# Altium schematic sheet Sheet1.SchDoc
size A4
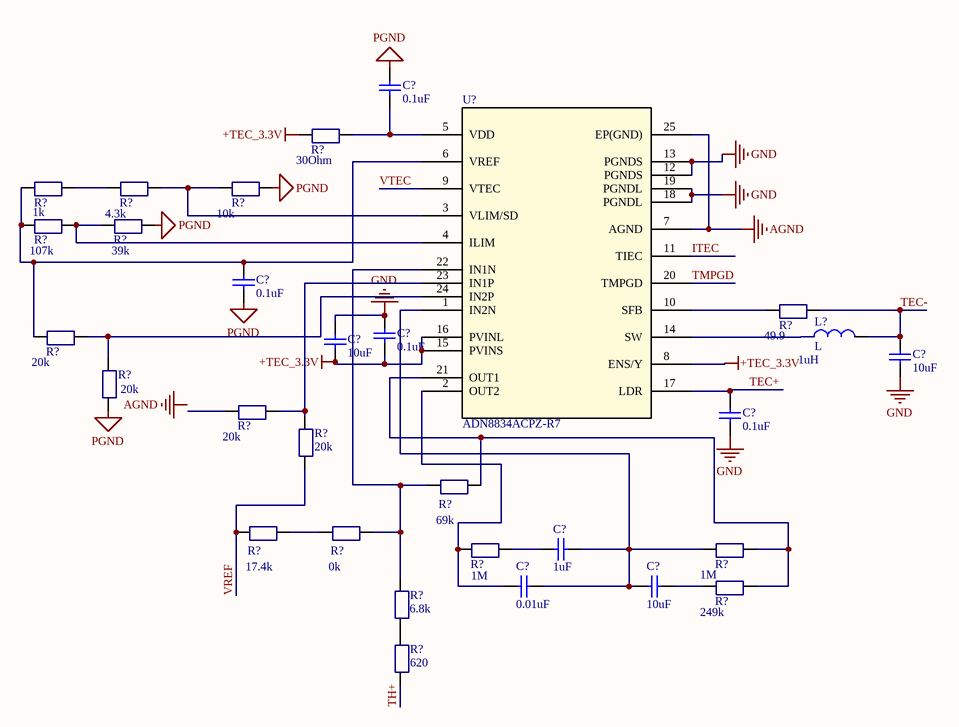
[diagram p0: Sheet1.SchDoc]

## Parts
(Parts that share a designator on the sheet are numbered #1, #2 ... from top to bottom, then left to right.)
C?#1  value 0.1uF  [0603-1]  (hidden comment: Cap)
C?#2  value 0.1uF  [0603-1]  (hidden comment: Cap)
C?#3  value 0.1uF  [0603-1]  (hidden comment: Cap)
C?#4  value 10uF  [0603-1]  (hidden comment: Cap)
C?#5  value 10uF  [0603-1]  (hidden comment: Cap)
C?#6  value 0.1uF  [0603-1]  (hidden comment: Cap)
C?#7  value 1uF  [0603-1]  (hidden comment: Cap)
C?#8  value 0.01uF  [0603-1]  (hidden comment: Cap)
C?#9  value 10uF  [0603-1]  (hidden comment: Cap)
L?  L  [C0805]
R?#1  Resistance  [R0402]  (value not drawn)
R?#2  Resistance  [R1210]  (value not drawn)
R?#3  Resistance  [R1210]  (value not drawn)
R?#4  Resistance  [R0402]  (value not drawn)
R?#5  Resistance  [R0402]  (value not drawn)
R?#6  Resistance  [R1210]  (value not drawn)
R?#7  Resistance  [R0402]  (value not drawn)
R?#8  Resistance  [R1210]  (value not drawn)
R?#9  Resistance  [R1210]  (value not drawn)
R?#10  Resistance  [R1210]  (value not drawn)
R?#11  Resistance  [R1210]  (value not drawn)
R?#12  Resistance  [R0402]  (value not drawn)
R?#13  Resistance  [R0402]  (value not drawn)
R?#14  Resistance  [R0402]  (value not drawn)
R?#15  Resistance  [R0402]  (value not drawn)
R?#16  Resistance  [R0402]  (value not drawn)
R?#17  Resistance  [R0402]  (value not drawn)
R?#18  Resistance  [R0402]  (value not drawn)
R?#19  Resistance  [R0402]  (value not drawn)
U?  ADN8834ACPZ-R7  [CP_24_7]

## Nets
+TEC_3.3V: C?#3.2 C?#4.2 R?#1.1 U?.8(ENS/Y) U?.15(PVINS) U?.16(PVINL)
AGND: U?.7(AGND) U?.25(EP(GND))
GND: C?#3.1 C?#4.1 C?#5.1 C?#6.2 U?.12(PGNDS) U?.13(PGNDS) U?.18(PGNDL) U?.19(PGNDL)
PGND: C?#1.1 C?#2.2 R?#4.2 R?#6.2 R?#9.1
ITEC: U?.11(TIEC)
TEC+: C?#6.1 U?.17(LDR)
TEC-: C?#5.2 L?.1 R?#7.2
TH+: R?#19.1
TMPGD: U?.20(TMPGD)
VREF: R?#11.1 R?#13.1
VTEC: U?.9(VTEC)
NetC?#1_2: C?#1.2 R?#1.2 U?.5(VDD)
NetC?#2_1: C?#2.1 R?#2.1 R?#5.1 R?#8.1 U?.6(VREF)
NetC?#7_1: C?#7.1 R?#15.2
NetC?#7_2: C?#7.2 C?#8.2 C?#9.1 R?#16.1 U?.1(IN2N)
NetC?#8_1: C?#8.1 R?#15.1 U?.2(OUT2)
NetC?#9_2: C?#9.2 R?#17.1
NetL?_2: L?.2 U?.14(SW)
NetR?#2_2: R?#2.2 R?#3.1
NetR?#3_2: R?#3.2 R?#4.1 U?.3(VLIM/SD)
NetR?#5_2: R?#5.2 R?#6.1 U?.4(ILIM)
NetR?#7_1: R?#7.1 U?.10(SFB)
NetR?#8_2: R?#8.2 R?#9.2 U?.24(IN2P)
NetR?#10_2: R?#10.2 R?#11.2 U?.23(IN1P)
NetR?#12_1: R?#12.1 R?#14.2 R?#18.2 U?.22(IN1N)
NetR?#12_2: R?#12.2 R?#16.2 R?#17.2 U?.21(OUT1)
NetR?#13_2: R?#13.2 R?#14.1
NetR?#18_1: R?#18.1 R?#19.2

Not connected (* = marked no-connect by the designer): R?#10 1

## Notes on the sheet
- Labels drawn without touching a wire or pin: AGND
- (in symbol L) 1uH
- (in symbol Resistance) 30Ohm; 10k; 4.3k; 39k; 107k; 20k; 17.4k; 49.9; 1M; 249k; 6.8k; 1k; 0k; 620; 69k

## Library data of the parts
C?#1-C?#9 = Cap: 无极性电容; Published: 8-Jun-2000; LatestRevisionDate: 17-Jul-2002; LatestRevisionNote: Re-released for DXP Platform.; PackageReference: RAD-0.3; Publisher: Altium Limited
U? = ADN8834ACPZ-R7: No Description Available; Copyright: Copyright (C) 2018 Accelerated Designs. All rights reserved; RefDes: RefDes; Type: DEV; Value: Value